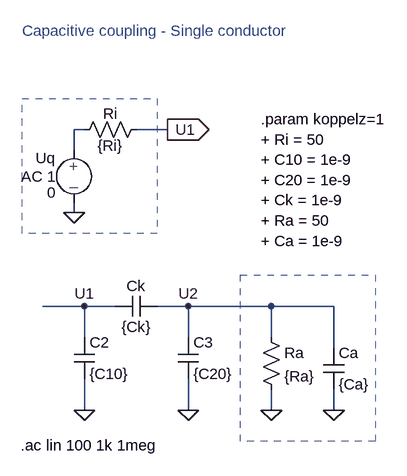
[diagram p0: schematic kapaz_kopplung.asc]
kapaz_kopplung.asc, the LTspice schematic file:
Version 4
SHEET 1 880 680
WIRE -256 -128 -272 -128
WIRE -128 -128 -176 -128
WIRE -272 -96 -272 -128
WIRE -272 0 -272 -16
WIRE -256 144 -320 144
WIRE -208 144 -256 144
WIRE -96 144 -144 144
WIRE 32 144 -96 144
WIRE 128 144 32 144
WIRE -256 192 -256 144
WIRE -96 192 -96 144
WIRE 32 192 32 144
WIRE 128 208 128 144
WIRE -256 304 -256 256
WIRE -96 304 -96 256
WIRE 32 304 32 272
WIRE 128 304 128 272
FLAG 32 304 0
FLAG -96 304 0
FLAG -256 304 0
FLAG -272 0 0
FLAG -256 144 U1
FLAG -96 144 U2
FLAG 128 304 0
FLAG -128 -128 U1
IOPIN -128 -128 Out
SYMBOL cap -208 160 R270
WINDOW 0 32 32 VTop 2
WINDOW 3 0 32 VBottom 2
SYMATTR InstName Ck
SYMATTR Value {Ck}
SYMBOL cap -272 192 R0
SYMATTR InstName C2
SYMATTR Value {C10}
SYMBOL cap -112 192 R0
SYMATTR InstName C3
SYMATTR Value {C20}
SYMBOL res -272 -112 R270
WINDOW 0 25 56 VTop 2
WINDOW 3 7 56 VBottom 2
SYMATTR InstName Ri
SYMATTR Value {Ri}
SYMBOL res 16 176 R0
SYMATTR InstName Ra
SYMATTR Value {Ra}
SYMBOL BOR_sym\\source-V -272 -112 M0
WINDOW 123 28 56 Left 2
WINDOW 39 0 0 Left 2
SYMATTR InstName Uq
SYMATTR Value 0
SYMATTR Value2 AC 1
SYMBOL cap 112 208 R0
SYMATTR InstName Ca
SYMATTR Value {Ca}
TEXT 16 -144 Left 2 !.param koppelz=1\n+ Ri = 50\n+ C10 = 1e-9\n+ C20 = 1e-9\n+ Ck = 1e-9\n+ Ra = 50\n+ Ca = 1e-9
TEXT -352 -280 Left 2 ;Capacitive coupling - Single conductor
TEXT -354 358 Left 2 !.ac lin 100 1k 1meg
RECTANGLE Normal -144 32 -352 -176 2
RECTANGLE Normal 192 352 -16 96 2

The netlist it stands for:
* kapaz_kopplung.asc
Ck U1 U2 {Ck}
C2 U1 0 {C10}
C3 U2 0 {C20}
Ri N001 U1 {Ri}
Ra U2 0 {Ra}
V§Uq N001 0 0 AC 1
Ca U2 0 {Ca}
.param koppelz=1
+ Ri = 50
+ C10 = 1e-9
+ C20 = 1e-9
+ Ck = 1e-9
+ Ra = 50
+ Ca = 1e-9
* Capacitive coupling - Single conductor
.ac lin 100 1k 1meg
.backanno
.end

* Results of the author's LTspice run, read from the files saved beside the schematic
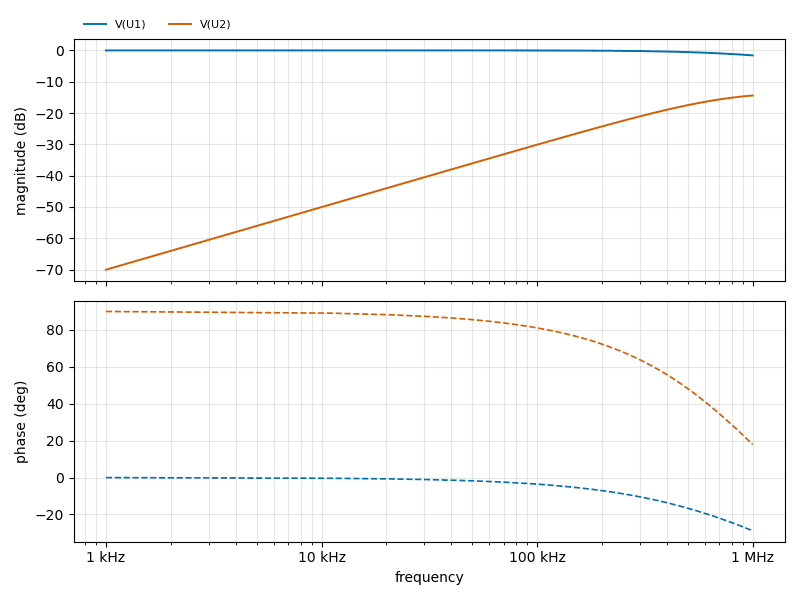
[diagram p1: AC Analysis of kapaz_kopplung.asc, plotted from the saved traces]
* AC Analysis, 1 run:
*   V(U1): -0.00 dB at 1 kHz, -1.59 dB at 1 MHz, peak -0.00 dB at 1 kHz
*   V(U2): -70.06 dB at 1 kHz, -14.41 dB at 1 MHz, peak -14.41 dB at 1 MHz, 3 dB below the peak at 506 kHz